# Altium schematic sheet humiditycontrol.SchDoc
size A
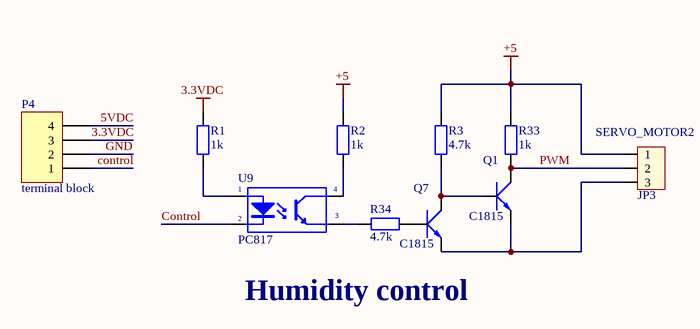
[diagram p0: humiditycontrol.SchDoc]

## Parts
P4  terminal block  [HDR1X4]
Q1  C1815  [QTO-92]
Q7  C1815  [QTO-92]
R1  1k  [R1/4W]
R2  1k  [R1/4W]
R3  4.7k  [R1/4W]
R33  1k  [R1/4W]
R34  4.7k  [R1/4W]
SERVO_MOTOR2  JP3  [CON3]
U9  PC817  [DIP4/W0.3]

## Nets
3.3VDC: P4.3 R1.2
+5: R2.2 R3.2 R33.2 SERVO_MOTOR2.1
5VDC: P4.4
Control: P4.1 U9.2(K)
GND: P4.2
PWM: Q1.2(C) R33.1 SERVO_MOTOR2.2
NetQ1_1: Q1.1(E) Q7.1(E) SERVO_MOTOR2.3
NetQ1_3: Q1.3(B) Q7.2(C) R3.1
NetQ7_3: Q7.3(B) R34.1
NetR1_1: R1.1 U9.1(A)
NetR2_1: R2.1 U9.4(C)
NetR34_2: R34.2 U9.3(E)

## Notes on the sheet
- Humidity control

## Library data of the parts
P4 = Header 4: Header, 4-Pin; LatestRevisionDate: 17-Jul-2002; LatestRevisionNote: Re-released for DXP Platform.; Publisher: Altium Limited
Q1 Q7 = C1815: NPN 600mW, ECB; Value: C1815
R1-R3 R33 R34 = R1/4W: Resistor 1/4W; Value: R1/4W - 1K
SERVO_MOTOR2 = Con3: Connector 3; Value: Connector 3
U9 = PC817: Single Opto; Value: PC817